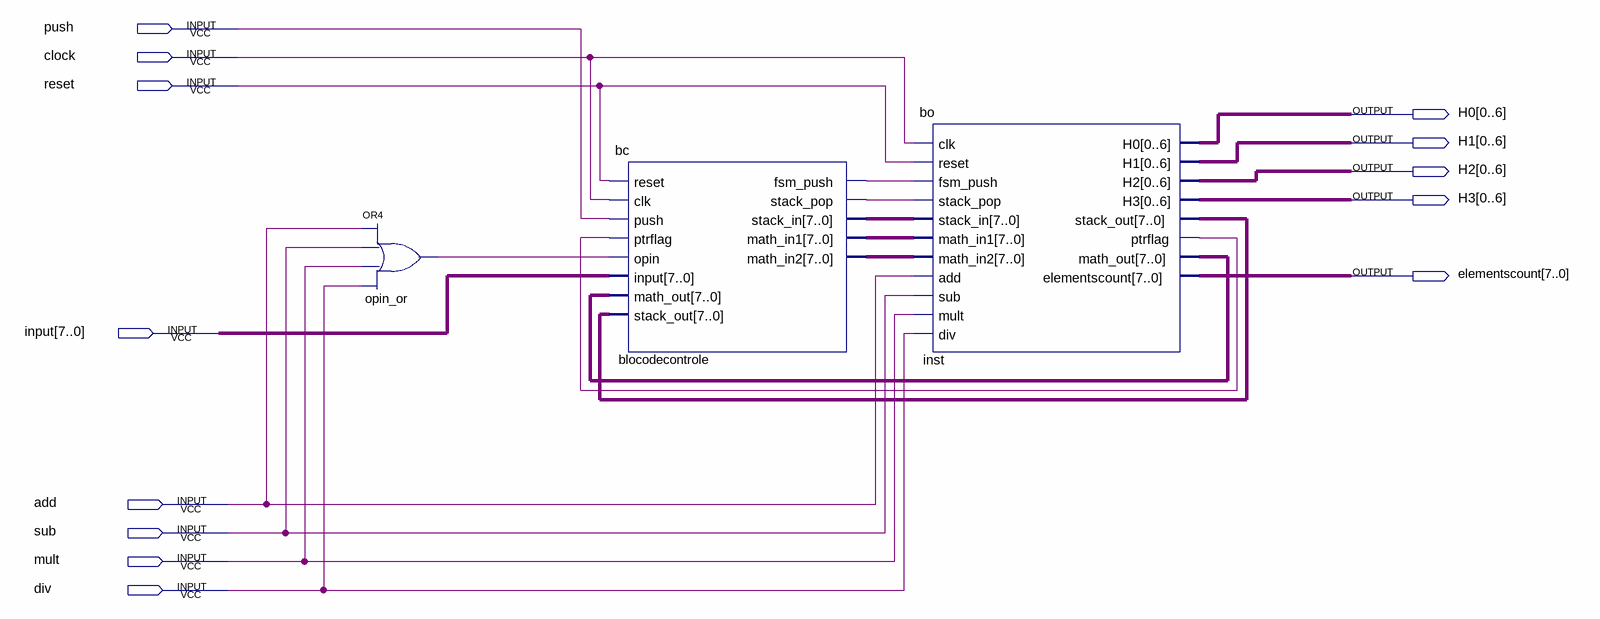
[diagram p0: schematic sheet]
// Quartus schematic calculator.bdf as structural Verilog: 3 symbols, 13 pins
module calculator (
  input  push,
  input  clock,
  input  reset,
  input  [7:0] \input ,
  input  add,
  input  sub,
  input  mult,
  input  div,
  output [0:6] H0,
  output [0:6] H1,
  output [0:6] H2,
  output [0:6] H3,
  output [7:0] elementscount
);

  wire blocodecontrole_fsm_push, blocodecontrole_stack_pop, inst_ptrflag, opin_or_out;
  wire [7:0] blocodecontrole_math_in1, blocodecontrole_math_in2, blocodecontrole_stack_in, inst_math_out,
       inst_stack_out;

  or opin_or (opin_or_out, add, sub, mult, div);
  bc blocodecontrole (
    .reset(reset), .clk(clock), .push(push), .ptrflag(inst_ptrflag), .opin(opin_or_out), .\input (\input ),
    .math_out(inst_math_out), .stack_out(inst_stack_out), .fsm_push(blocodecontrole_fsm_push),
    .stack_pop(blocodecontrole_stack_pop), .stack_in(blocodecontrole_stack_in),
    .math_in1(blocodecontrole_math_in1), .math_in2(blocodecontrole_math_in2));
  bo inst (
    .clk(clock), .reset(reset), .fsm_push(blocodecontrole_fsm_push), .stack_pop(blocodecontrole_stack_pop),
    .stack_in(blocodecontrole_stack_in), .math_in1(blocodecontrole_math_in1),
    .math_in2(blocodecontrole_math_in2), .add(add), .sub(sub), .mult(mult), .div(div), .H0(H0), .H1(H1),
    .H2(H2), .H3(H3), .stack_out(inst_stack_out), .ptrflag(inst_ptrflag), .math_out(inst_math_out),
    .elementscount(elementscount));
endmodule
